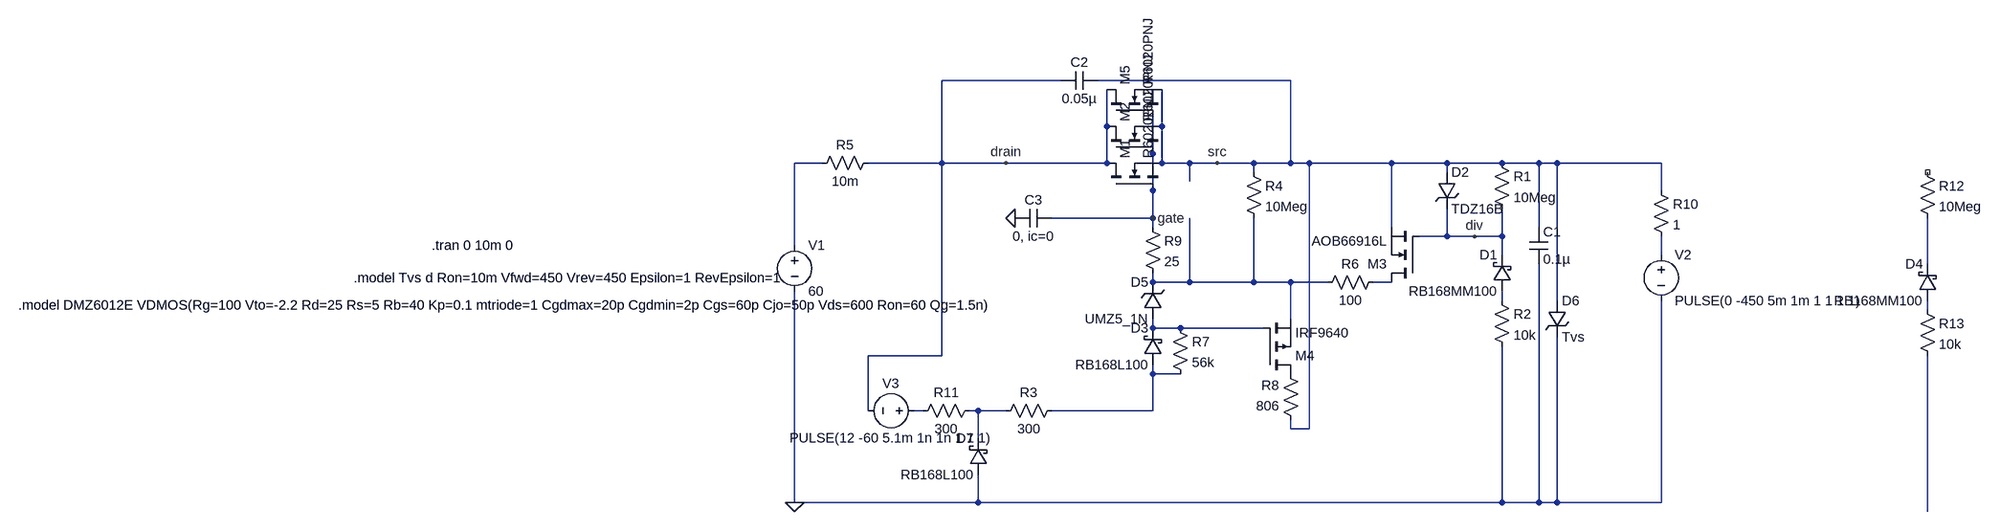
[diagram p0: schematic FET Driver rev2 dep_fet_test.asc]
FET Driver rev2 dep_fet_test.asc, the LTspice schematic file:
Version 4
SHEET 1 1884 732
WIRE 0 -112 -208 -112
WIRE 400 -112 64 -112
WIRE 80 -32 80 -96
WIRE 176 -32 176 -96
WIRE 160 16 160 -48
WIRE -416 32 -464 32
WIRE -208 32 -208 -112
WIRE -208 32 -336 32
WIRE -96 32 -208 32
WIRE 80 32 80 -32
WIRE 80 32 -96 32
WIRE 176 32 176 -32
WIRE 224 32 176 32
WIRE 272 32 224 32
WIRE 336 32 272 32
WIRE 400 32 400 -112
WIRE 400 32 336 32
WIRE 432 32 400 32
WIRE 576 32 432 32
WIRE 672 32 576 32
WIRE 768 32 672 32
WIRE 832 32 768 32
WIRE 864 32 832 32
WIRE 1072 32 864 32
WIRE 336 48 336 32
WIRE 672 48 672 32
WIRE 224 64 224 32
WIRE 160 80 160 16
WIRE 1072 80 1072 32
WIRE 160 128 160 80
WIRE 160 128 -16 128
WIRE 160 144 160 128
WIRE 576 144 576 32
WIRE 832 144 832 32
WIRE 672 160 672 112
WIRE 672 160 624 160
WIRE 720 160 672 160
WIRE 768 160 768 112
WIRE 768 160 720 160
WIRE -464 176 -464 32
WIRE 768 192 768 160
WIRE 1072 192 1072 160
WIRE 1536 208 1536 128
WIRE 160 240 160 224
WIRE 224 240 224 128
WIRE 224 240 160 240
WIRE 336 240 336 128
WIRE 336 240 224 240
WIRE 400 240 336 240
WIRE 464 240 400 240
WIRE 576 240 544 240
WIRE 768 272 768 256
WIRE 864 272 864 32
WIRE 1536 288 1536 272
WIRE 400 304 400 240
WIRE 160 320 160 304
WIRE 208 320 160 320
WIRE 352 320 208 320
WIRE -208 368 -208 32
WIRE -208 368 -336 368
WIRE 160 400 160 384
WIRE 208 400 160 400
WIRE -336 464 -336 368
WIRE -240 464 -256 464
WIRE -144 464 -160 464
WIRE -96 464 -144 464
WIRE 160 464 160 400
WIRE 160 464 -16 464
WIRE 400 496 400 480
WIRE 432 496 432 32
WIRE 432 496 400 496
WIRE -144 512 -144 464
WIRE -464 624 -464 256
WIRE -144 624 -144 576
WIRE -144 624 -464 624
WIRE 768 624 768 352
WIRE 768 624 -144 624
WIRE 832 624 832 208
WIRE 832 624 768 624
WIRE 864 624 864 336
WIRE 864 624 832 624
WIRE 1072 624 1072 272
WIRE 1072 624 864 624
WIRE 1536 640 1536 368
FLAG 720 160 div
FLAG 272 32 src
FLAG 160 128 gate
FLAG -464 624 0
FLAG -80 128 0
FLAG -96 32 drain
SYMBOL nmos 80 80 R270
SYMATTR InstName M1
SYMATTR Value R6020PNJ
SYMBOL voltage -464 160 R0
WINDOW 123 0 0 Left 0
WINDOW 39 0 0 Left 0
SYMATTR InstName V1
SYMATTR Value 60
SYMBOL voltage 1072 176 R0
WINDOW 123 0 0 Left 0
WINDOW 39 0 0 Left 0
SYMATTR InstName V2
SYMATTR Value PULSE(0 -450 5m 1m 1 1 1 1)
SYMBOL res 752 16 R0
SYMATTR InstName R1
SYMATTR Value 10Meg
SYMBOL schottky 784 256 R180
WINDOW 0 24 64 Left 2
WINDOW 3 24 0 Left 2
SYMATTR InstName D1
SYMATTR Value RB168MM100
SYMATTR Description Diode
SYMATTR Type diode
SYMBOL res 752 256 R0
SYMATTR InstName R2
SYMATTR Value 10k
SYMBOL zener 656 48 R0
SYMATTR InstName D2
SYMATTR Value TDZ16B
SYMATTR Description Diode
SYMATTR Type diode
SYMBOL nmos 624 240 R180
SYMATTR InstName M3
SYMATTR Value AOB66916L
SYMBOL voltage -240 464 R90
WINDOW 0 -32 56 VBottom 2
WINDOW 3 32 56 VTop 2
WINDOW 123 0 0 Left 0
WINDOW 39 0 0 Left 0
SYMATTR InstName V3
SYMATTR Value PULSE(12 -60 5.1m 1n 1n 1 1 1)
SYMBOL res -432 48 R270
WINDOW 0 32 56 VTop 2
WINDOW 3 0 56 VBottom 2
SYMATTR InstName R5
SYMATTR Value 10m
SYMBOL res 560 224 R90
WINDOW 0 0 56 VBottom 2
WINDOW 3 32 56 VTop 2
SYMATTR InstName R6
SYMATTR Value 100
SYMBOL res 320 32 R0
SYMATTR InstName R4
SYMATTR Value 10Meg
SYMBOL schottky 176 384 R180
WINDOW 0 24 64 Left 2
WINDOW 3 24 0 Left 2
SYMATTR InstName D3
SYMATTR Value RB168L100
SYMATTR Description Diode
SYMATTR Type diode
SYMBOL zener 176 304 R180
WINDOW 0 24 64 Left 2
WINDOW 3 24 0 Left 2
SYMATTR InstName D5
SYMATTR Value UMZ5_1N
SYMATTR Description Diode
SYMATTR Type diode
SYMBOL pmos 352 400 M180
SYMATTR InstName M4
SYMATTR Value IRF9640
SYMBOL res 192 304 R0
SYMATTR InstName R7
SYMATTR Value 56k
SYMBOL res 416 496 R180
WINDOW 0 36 76 Left 2
WINDOW 3 36 40 Left 2
SYMATTR InstName R8
SYMATTR Value 806
SYMBOL TVSdiode 848 272 R0
SYMATTR InstName D6
SYMATTR Value Tvs
SYMBOL cap 816 144 R0
SYMATTR InstName C1
SYMATTR Value 0.1µ
SYMBOL cap 64 -128 R90
WINDOW 0 0 32 VBottom 2
WINDOW 3 32 32 VTop 2
SYMATTR InstName C2
SYMATTR Value 0.05µ
SYMBOL res 144 128 R0
SYMATTR InstName R9
SYMATTR Value 25
SYMBOL res 1056 64 R0
SYMATTR InstName R10
SYMATTR Value 1
SYMBOL cap -16 112 R90
WINDOW 0 0 32 VBottom 2
WINDOW 3 32 32 VTop 2
SYMATTR InstName C3
SYMATTR Value 0, ic=0
SYMBOL schottky -128 576 R180
WINDOW 0 24 64 Left 2
WINDOW 3 24 0 Left 2
SYMATTR InstName D7
SYMATTR Value RB168L100
SYMATTR Description Diode
SYMATTR Type diode
SYMBOL res -144 448 R90
WINDOW 0 0 56 VBottom 2
WINDOW 3 32 56 VTop 2
SYMATTR InstName R11
SYMATTR Value 300
SYMBOL res 0 448 R90
WINDOW 0 0 56 VBottom 2
WINDOW 3 32 56 VTop 2
SYMATTR InstName R3
SYMATTR Value 300
SYMBOL nmos 80 16 R270
SYMATTR InstName M2
SYMATTR Value R6020PNJ
SYMBOL nmos 80 -48 R270
SYMATTR InstName M5
SYMATTR Value R6020PNJ
SYMBOL res 1520 32 R0
SYMATTR InstName R12
SYMATTR Value 10Meg
SYMBOL schottky 1552 272 R180
WINDOW 0 24 64 Left 2
WINDOW 3 24 0 Left 2
SYMATTR InstName D4
SYMATTR Value RB168MM100
SYMATTR Description Diode
SYMATTR Type diode
SYMBOL res 1520 272 R0
SYMATTR InstName R13
SYMATTR Value 10k
TEXT -1096 176 Left 2 !.tran 0 10m 0
TEXT -1232 232 Left 2 !.model Tvs d Ron=10m Vfwd=450 Vrev=450 Epsilon=1 RevEpsilon=1
TEXT -1816 280 Left 2 !.model DMZ6012E VDMOS(Rg=100 Vto=-2.2 Rd=25 Rs=5 Rb=40 Kp=0.1 mtriode=1 Cgdmax=20p Cgdmin=2p Cgs=60p Cjo=50p Vds=600 Ron=60 Qg=1.5n)

The netlist it stands for:
* FET Driver rev2 dep_fet_test.asc
M1 drain gate src src R6020PNJ
V1 N001 0 60
V2 N002 0 PULSE(0 -450 5m 1m 1 1 1 1)
R1 src div 10Meg
D1 N006 div RB168MM100
R2 N006 0 10k
D2 src div TDZ16B
M3 N005 div src src AOB66916L
V3 N010 drain PULSE(12 -60 5.1m 1n 1n 1 1 1)
R5 N001 drain 10m
R6 N005 N004 100
R4 src N004 10Meg
D3 N009 N008 RB168L100
D5 N008 N004 UMZ5_1N
M4 P001 N008 N004 N004 IRF9640
R7 N008 N009 56k
R8 src P001 806
D6 src 0 Tvs
C1 src 0 0.1µ
C2 src drain 0.05µ
R9 gate N004 25
R10 src N002 1
C3 gate 0 0, ic=0
D7 0 N011 RB168L100
R11 N011 N010 300
R3 N009 N011 300
M2 drain gate src src R6020PNJ
M5 drain gate src src R6020PNJ
R12 NC_01 N003 10Meg
D4 N007 N003 RB168MM100
R13 N007 N012 10k
.model D D
.lib standard.dio
.model NMOS NMOS
.model PMOS PMOS
.lib standard.mos
.tran 0 10m 0
.model Tvs d Ron=10m Vfwd=450 Vrev=450 Epsilon=1 RevEpsilon=1
.model DMZ6012E VDMOS(Rg=100 Vto=-2.2 Rd=25 Rs=5 Rb=40 Kp=0.1 mtriode=1 Cgdmax=20p Cgdmin=2p Cgs=60p Cjo=50p Vds=600 Ron=60 Qg=1.5n)
.backanno
.end